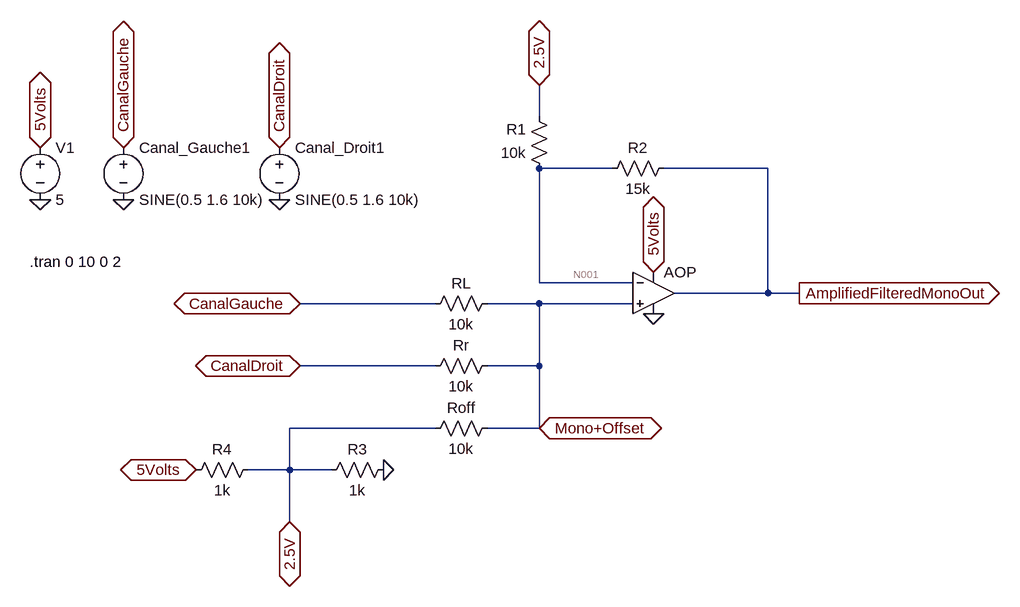
[diagram p0: schematic Conditionner.asc]
Conditionner.asc, the LTspice schematic file:
Version 4
SHEET 1 1148 680
WIRE 48 -176 48 -224
WIRE 160 -96 48 -96
WIRE 400 -96 240 -96
WIRE 48 80 48 -96
WIRE 192 80 48 80
WIRE 400 96 400 -96
WIRE 400 96 256 96
WIRE 448 96 400 96
WIRE -112 112 -320 112
WIRE 48 112 -32 112
WIRE 192 112 48 112
WIRE -112 208 -320 208
WIRE 48 208 48 112
WIRE 48 208 -32 208
WIRE -112 304 -336 304
WIRE 48 304 48 208
WIRE 48 304 -32 304
WIRE -336 368 -336 304
WIRE -336 368 -400 368
WIRE -272 368 -336 368
WIRE -336 448 -336 368
FLAG 448 96 AmplifiedFilteredMonoOut
IOPIN 448 96 Out
FLAG -192 368 0
FLAG -320 112 CanalGauche
IOPIN -320 112 BiDir
FLAG -320 208 CanalDroit
IOPIN -320 208 BiDir
FLAG 224 64 5Volts
IOPIN 224 64 BiDir
FLAG -720 -128 5Volts
IOPIN -720 -128 BiDir
FLAG -720 -48 0
FLAG -352 -48 0
FLAG -592 -48 0
FLAG -592 -128 CanalGauche
IOPIN -592 -128 BiDir
FLAG -352 -128 CanalDroit
IOPIN -352 -128 BiDir
FLAG -480 368 5Volts
IOPIN -480 368 BiDir
FLAG -336 448 2.5V
IOPIN -336 448 BiDir
FLAG 224 128 0
FLAG 48 -224 2.5V
IOPIN 48 -224 BiDir
FLAG 48 304 Mono+Offset
IOPIN 48 304 BiDir
SYMBOL res 64 -80 R180
WINDOW 0 36 76 Left 2
WINDOW 3 36 40 Left 2
SYMATTR InstName R1
SYMATTR Value 10k
SYMBOL res 256 -112 R90
WINDOW 0 0 56 VBottom 2
WINDOW 3 32 56 VTop 2
SYMATTR InstName R2
SYMATTR Value 15k
SYMBOL res -16 96 R90
WINDOW 0 0 56 VBottom 2
WINDOW 3 32 56 VTop 2
SYMATTR InstName RL
SYMATTR Value 10k
SYMBOL res -16 192 R90
WINDOW 0 0 56 VBottom 2
WINDOW 3 32 56 VTop 2
SYMATTR InstName Rr
SYMATTR Value 10k
SYMBOL res -128 320 R270
WINDOW 0 32 56 VTop 2
WINDOW 3 0 56 VBottom 2
SYMATTR InstName Roff
SYMATTR Value 10k
SYMBOL OpAmps\\UniversalOpAmp 224 96 R0
SYMATTR InstName AOP
SYMBOL res -176 352 R90
WINDOW 0 0 56 VBottom 2
WINDOW 3 32 56 VTop 2
SYMATTR InstName R3
SYMATTR Value 1k
SYMBOL res -384 352 R90
WINDOW 0 0 56 VBottom 2
WINDOW 3 32 56 VTop 2
SYMATTR InstName R4
SYMATTR Value 1k
SYMBOL voltage -720 -144 R0
WINDOW 123 0 0 Left 0
WINDOW 39 0 0 Left 0
SYMATTR InstName V1
SYMATTR Value 5
SYMBOL voltage -352 -144 R0
WINDOW 123 0 0 Left 0
WINDOW 39 0 0 Left 0
SYMATTR InstName Canal_Droit1
SYMATTR Value SINE(0.5 1.6 10k)
SYMBOL voltage -592 -144 R0
WINDOW 123 0 0 Left 0
WINDOW 39 0 0 Left 0
SYMATTR InstName Canal_Gauche1
SYMATTR Value SINE(0.5 1.6 10k)
TEXT -736 48 Left 2 !.tran 0 10 0 2

The netlist it stands for:
* Conditionner.asc
R1 N001 2.5V 10k
R2 AmplifiedFilteredMonoOut N001 15k
RL Mono+Offset CanalGauche 10k
Rr Mono+Offset CanalDroit 10k
Roff 2.5V Mono+Offset 10k
XAOP Mono+Offset N001 5Volts 0 AmplifiedFilteredMonoOut level1 Avol=1Meg GBW=10Meg Vos=0 En=0 Enk=0 In=0 Ink=0 Rin=500Meg  ; pins In+ In- V+ V- OUT
R3 0 2.5V 1k
R4 2.5V 5Volts 1k
V1 5Volts 0 5
V§Canal_Droit1 CanalDroit 0 SINE(0.5 1.6 10k)
V§Canal_Gauche1 CanalGauche 0 SINE(0.5 1.6 10k)
.tran 0 10 0 2
.lib UniversalOpAmp1.lib
.backanno
.end

* Results of the author's LTspice run, read from the files saved beside the schematic
* Operating Point, zero values left out:
*   V(n001) = 1.125 V
*   V(2.5v) = 2.375 V
*   V(amplifiedfilteredmonoout) = -750 mV
*   V(mono+offset) = 1.125 V
*   V(canalgauche) = 500 mV
*   V(canaldroit) = 500 mV
*   V(5volts) = 5 V
*   I(R1) = -125 µA
*   I(R2) = -125 µA
*   I(Rl) = 62.5 µA
*   I(Rr) = 62.5 µA
*   I(Roff) = 125 µA
*   I(R3) = -2.375 mA
*   I(R4) = -2.625 mA
*   I(V1) = -2.625 mA
*   I(Canal_droit1) = 62.5 µA
*   I(Canal_gauche1) = 62.5 µA
*   Ix(aop:1) = -2.75 nA
*   Ix(aop:2) = -2.75 nA
*   Ix(aop:3) = 7.75 nA
*   Ix(aop:4) = -2.25 nA
*   Ix(aop:5) = 125 µA